# EAGLE schematic Untitled (EAGLE 6.5.0)
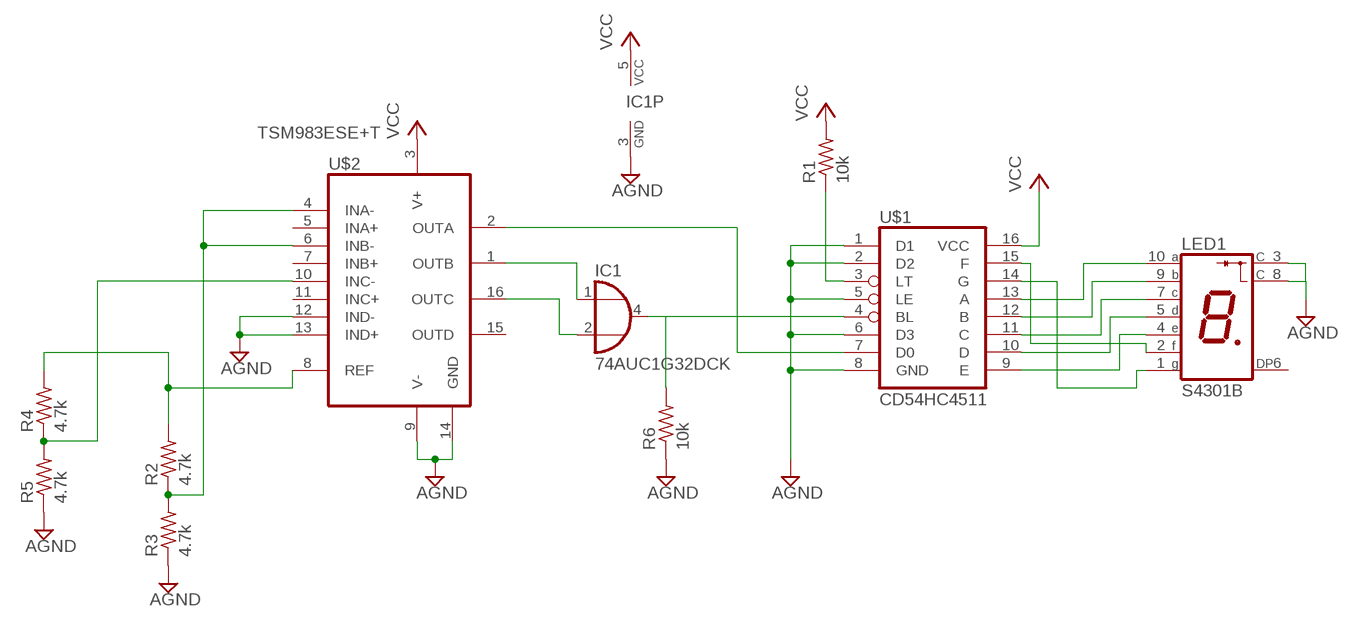
[diagram p0: schematic, sheet 1]

## Parts
IC1  74AUC1G32DCK  [SC70-5]
LED1  S4301B  [S4301B]
R1  10k  R-US_R1206  [R1206]
R2  4.7k  R-US_R1206  [R1206]
R3  4.7k  R-US_R1206  [R1206]
R4  4.7k  R-US_R1206  [R1206]
R5  4.7k  R-US_R1206  [R1206]
R6  10k  R-US_R1206  [R1206]
U$1  CD54HC4511  [CD54HC4511]
U$2  TSM983ESE+T  [TSM983ESE+T]

## Nets
AGND: IC1.3(GND) LED1.3(C) LED1.8(C) R3.1 R5.1 R6.1 U$1.1(D1) U$1.2(D2) U$1.5(LE) U$1.6(D3) U$1.8(GND) U$2.9(V-) U$2.12(IND-) U$2.13(IND+) U$2.14(GND)
N$1: IC1.1(I0) U$2.1(OUTB)
N$2: R1.1 U$1.3(LT)
N$3: IC1.4(O) R6.2 U$1.4(BL)
N$4: IC1.2(I1) U$2.16(OUTC)
N$5: R4.1 R5.2 U$2.10(INC-)
N$6: U$1.7(D0) U$2.2(OUTA)
N$7: R2.1 R3.2 U$2.4(INA-) U$2.6(INB-)
N$8: LED1.4(E) U$1.9(E)
N$9: LED1.5(D) U$1.10(D)
N$10: R2.2 R4.2 U$2.8(REF)
N$11: LED1.7(C) U$1.11(C)
N$12: LED1.9(B) U$1.12(B)
N$13: LED1.10(A) U$1.13(A)
N$14: LED1.1(G) U$1.14(G)
N$15: LED1.2(F) U$1.15(F)
VCC: IC1.5(VCC) R1.2 U$1.16(VCC) U$2.3(V+)
Unconnected: LED1.6(DP) U$2.5(INA+) U$2.7(INB+) U$2.11(INC+) U$2.15(OUTD)

## Library data of the parts
IC1 = 74xx-little-de:74*1G32: 2-input OR gate
LED1 = led-7-segment:S4301B: Single Digit Seven-Segment Display (cathode common) Source: LITEON .. S4301B.pdf; OC_FARNELL: unknown; OC_NEWARK: unknown
R1-R6 = rcl:R-US_: RESISTOR, American symbol
U$1 = ECE532_Parts:CD54HC4511
U$2 = ECE532_Parts:TSM983ESE+T